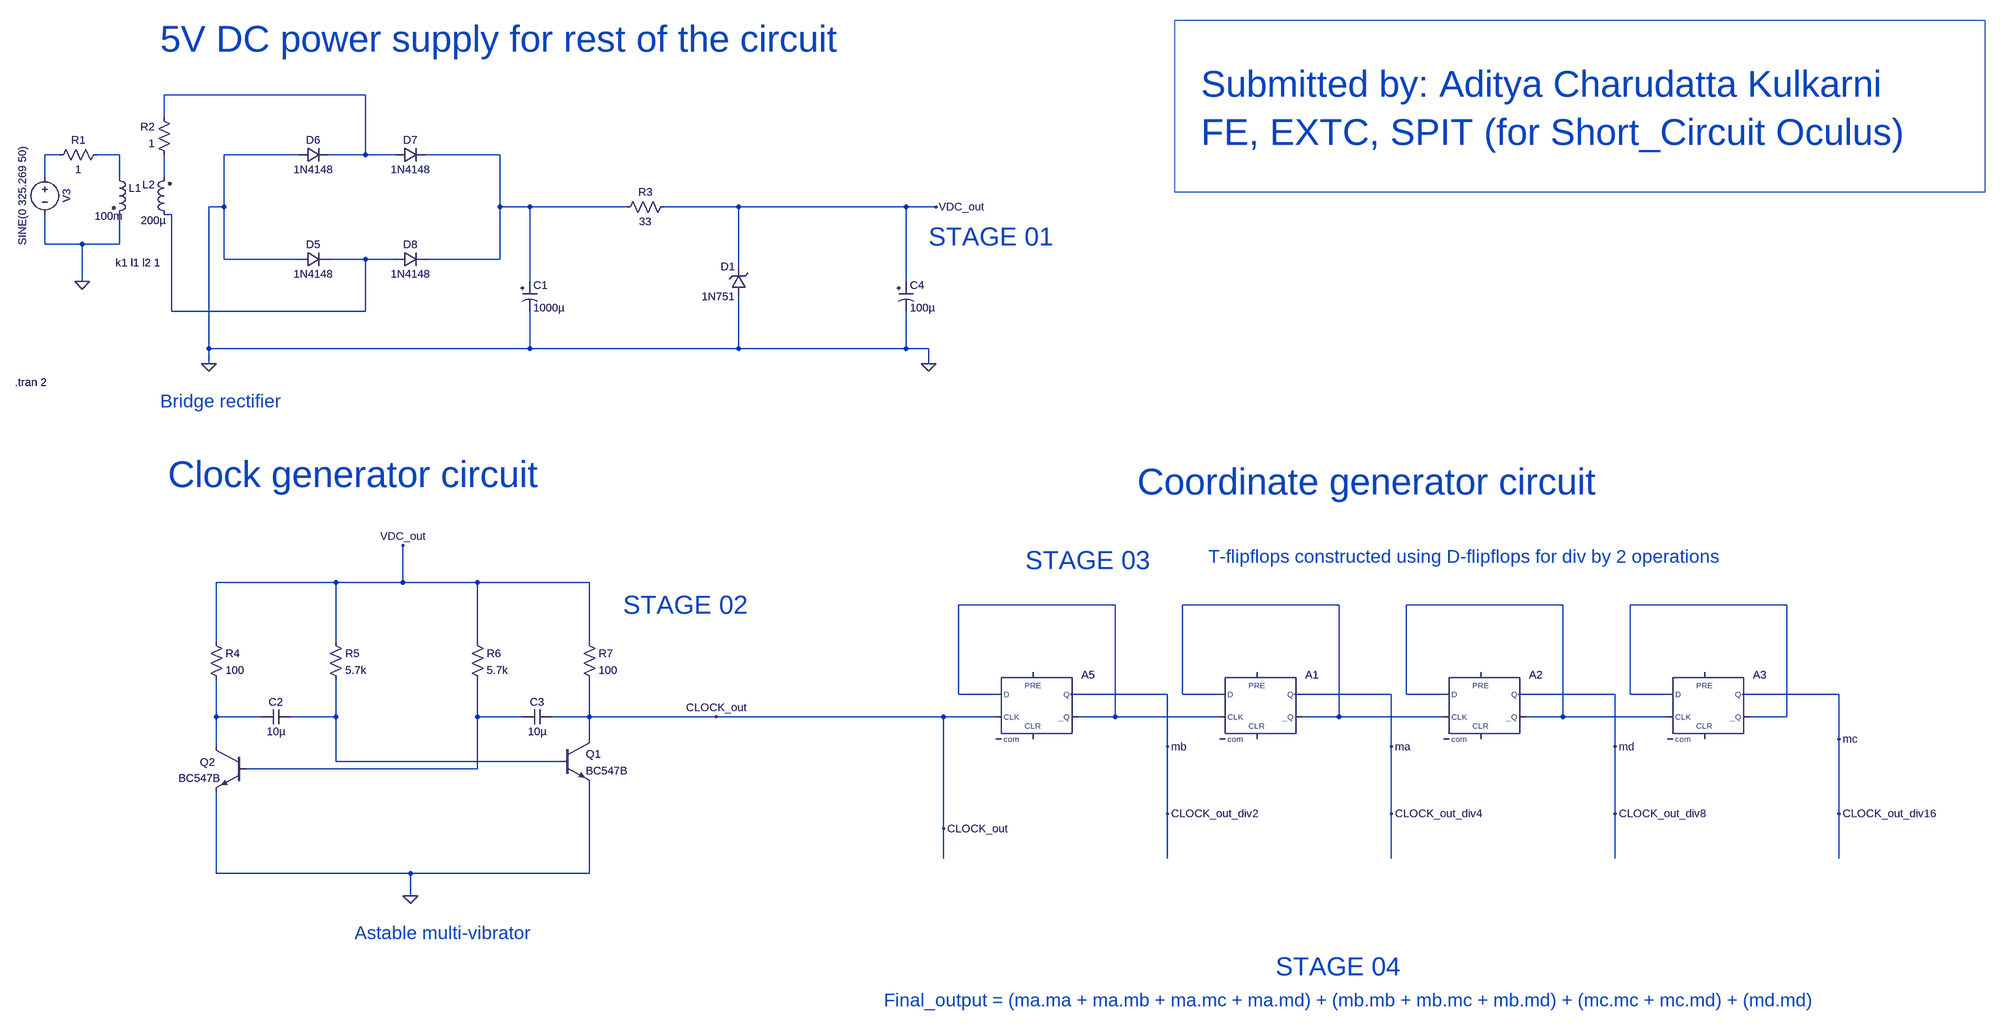
[diagram p0: schematic Oculuc_shortcircuit_powersupply.asc]
Oculuc_shortcircuit_powersupply.asc, the LTspice schematic file:
Version 4
SHEET 1 3616 2108
WIRE -512 80 -944 80
WIRE -944 128 -944 80
WIRE -1168 208 -1200 208
WIRE -1040 208 -1088 208
WIRE -656 208 -816 208
WIRE -512 208 -512 80
WIRE -512 208 -592 208
WIRE -448 208 -512 208
WIRE -224 208 -384 208
WIRE -1200 256 -1200 208
WIRE -1040 256 -1040 208
WIRE -944 256 -944 208
WIRE -816 320 -816 208
WIRE -816 320 -848 320
WIRE -224 320 -224 208
WIRE -160 320 -224 320
WIRE 48 320 -160 320
WIRE 288 320 128 320
WIRE 672 320 288 320
WIRE 736 320 672 320
WIRE -928 336 -944 336
WIRE -1200 400 -1200 336
WIRE -1120 400 -1200 400
WIRE -1040 400 -1040 336
WIRE -1040 400 -1120 400
WIRE -816 432 -816 320
WIRE -656 432 -816 432
WIRE -512 432 -592 432
WIRE -448 432 -512 432
WIRE -224 432 -224 320
WIRE -224 432 -384 432
WIRE 288 448 288 320
WIRE -1120 480 -1120 400
WIRE -160 480 -160 320
WIRE 672 480 672 320
WIRE -928 544 -928 336
WIRE -512 544 -512 432
WIRE -512 544 -928 544
WIRE -848 624 -848 320
WIRE -160 624 -160 544
WIRE -160 624 -848 624
WIRE 288 624 288 512
WIRE 288 624 -160 624
WIRE 672 624 672 544
WIRE 672 624 288 624
WIRE 720 624 672 624
WIRE -848 656 -848 624
WIRE 720 656 720 624
WIRE -576 1184 -832 1184
WIRE -432 1184 -432 1104
WIRE -432 1184 -576 1184
WIRE -272 1184 -432 1184
WIRE -32 1184 -272 1184
WIRE 1120 1232 784 1232
WIRE 1600 1232 1264 1232
WIRE 2080 1232 1744 1232
WIRE 2560 1232 2224 1232
WIRE -832 1312 -832 1184
WIRE -576 1312 -576 1184
WIRE -272 1312 -272 1184
WIRE -32 1312 -32 1184
WIRE 784 1424 784 1232
WIRE 864 1424 784 1424
WIRE 1232 1424 1024 1424
WIRE 1264 1424 1264 1232
WIRE 1344 1424 1264 1424
WIRE 1712 1424 1504 1424
WIRE 1744 1424 1744 1232
WIRE 1824 1424 1744 1424
WIRE 2192 1424 1984 1424
WIRE 2224 1424 2224 1232
WIRE 2304 1424 2224 1424
WIRE 2672 1424 2464 1424
WIRE -832 1472 -832 1392
WIRE -736 1472 -832 1472
WIRE -576 1472 -576 1392
WIRE -576 1472 -672 1472
WIRE -272 1472 -272 1392
WIRE -176 1472 -272 1472
WIRE -32 1472 -32 1392
WIRE -32 1472 -112 1472
WIRE 240 1472 -32 1472
WIRE 752 1472 240 1472
WIRE 864 1472 752 1472
WIRE 1120 1472 1120 1232
WIRE 1120 1472 1040 1472
WIRE 1344 1472 1120 1472
WIRE 1600 1472 1600 1232
WIRE 1600 1472 1520 1472
WIRE 1824 1472 1600 1472
WIRE 2080 1472 2080 1232
WIRE 2080 1472 2000 1472
WIRE 2304 1472 2080 1472
WIRE 2560 1472 2560 1232
WIRE 2560 1472 2480 1472
WIRE -32 1520 -32 1472
WIRE 2672 1520 2672 1424
WIRE -832 1536 -832 1472
WIRE 1232 1536 1232 1424
WIRE 1712 1536 1712 1424
WIRE 2192 1536 2192 1424
WIRE -576 1568 -576 1472
WIRE -96 1568 -576 1568
WIRE -272 1584 -272 1472
WIRE -272 1584 -768 1584
WIRE 1232 1680 1232 1536
WIRE 1712 1680 1712 1536
WIRE 2192 1680 2192 1536
WIRE 2672 1680 2672 1520
WIRE 752 1712 752 1472
WIRE 752 1776 752 1712
WIRE 1232 1776 1232 1680
WIRE 1712 1776 1712 1680
WIRE 2192 1776 2192 1680
WIRE 2672 1776 2672 1680
WIRE -832 1808 -832 1632
WIRE -416 1808 -832 1808
WIRE -32 1808 -32 1616
WIRE -32 1808 -416 1808
WIRE -416 1856 -416 1808
FLAG -848 656 0
FLAG -1120 480 0
FLAG 736 320 VDC_out
FLAG 720 656 0
FLAG -416 1856 0
FLAG -432 1104 VDC_out
FLAG 240 1472 CLOCK_out
FLAG 1712 1680 CLOCK_out_div4
FLAG 2192 1680 CLOCK_out_div8
FLAG 2672 1680 CLOCK_out_div16
FLAG 1232 1680 CLOCK_out_div2
FLAG 752 1712 CLOCK_out
FLAG 1712 1536 ma
FLAG 1232 1536 mb
FLAG 2192 1536 md
FLAG 2672 1520 mc
SYMBOL voltage -1200 240 R0
WINDOW 0 32 56 VTop 2
WINDOW 3 -32 56 VBottom 2
WINDOW 123 0 0 Left 0
WINDOW 39 0 0 Left 0
SYMATTR InstName V3
SYMATTR Value SINE(0 325.269 50)
SYMBOL diode -656 448 R270
WINDOW 0 32 32 VTop 2
WINDOW 3 0 32 VBottom 2
SYMATTR InstName D5
SYMATTR Value 1N4148
SYMBOL diode -656 224 R270
WINDOW 0 32 32 VTop 2
WINDOW 3 0 32 VBottom 2
SYMATTR InstName D6
SYMATTR Value 1N4148
SYMBOL diode -448 224 R270
WINDOW 0 32 32 VTop 2
WINDOW 3 0 32 VBottom 2
SYMATTR InstName D7
SYMATTR Value 1N4148
SYMBOL diode -448 448 R270
WINDOW 0 32 32 VTop 2
WINDOW 3 0 32 VBottom 2
SYMATTR InstName D8
SYMATTR Value 1N4148
SYMBOL polcap -176 480 R0
WINDOW 3 24 56 Left 2
SYMATTR Value 1000µ
SYMATTR InstName C1
SYMATTR Description Capacitor
SYMATTR Type cap
SYMATTR SpiceLine V=2 Irms=3 Rser=0.006 Lser=0
SYMBOL ind2 -1056 240 R0
WINDOW 3 -37 100 Left 2
SYMATTR Value 100m
SYMATTR InstName L1
SYMATTR Type ind
SYMBOL ind2 -928 352 R180
WINDOW 0 36 80 Left 2
WINDOW 3 12 3 Left 2
SYMATTR InstName L2
SYMATTR Value 200µ
SYMATTR Type ind
SYMBOL res -1072 192 R90
WINDOW 0 0 56 VBottom 2
WINDOW 3 32 56 VTop 2
SYMATTR InstName R1
SYMATTR Value 1
SYMBOL res -928 224 R180
WINDOW 0 36 76 Left 2
WINDOW 3 36 40 Left 2
SYMATTR InstName R2
SYMATTR Value 1
SYMBOL zener 304 512 R180
WINDOW 0 24 64 Left 2
WINDOW 3 24 0 Left 2
SYMATTR InstName D1
SYMATTR Value 1N751
SYMBOL res 144 304 R90
WINDOW 0 0 56 VBottom 2
WINDOW 3 32 56 VTop 2
SYMATTR InstName R3
SYMATTR Value 33
SYMBOL res -848 1296 R0
SYMATTR InstName R4
SYMATTR Value 100
SYMBOL res -592 1296 R0
SYMATTR InstName R5
SYMATTR Value 5.7k
SYMBOL res -288 1296 R0
SYMATTR InstName R6
SYMATTR Value 5.7k
SYMBOL res -48 1296 R0
SYMATTR InstName R7
SYMATTR Value 100
SYMBOL npn -96 1520 R0
SYMATTR InstName Q1
SYMATTR Value BC547B
SYMBOL npn -768 1536 M0
WINDOW 0 67 34 Left 2
SYMATTR InstName Q2
SYMATTR Value BC547B
SYMBOL cap -672 1456 R90
WINDOW 0 0 32 VBottom 2
WINDOW 3 32 32 VTop 2
SYMATTR InstName C2
SYMATTR Value 10µ
SYMBOL cap -112 1456 R90
WINDOW 0 0 32 VBottom 2
WINDOW 3 32 32 VTop 2
SYMATTR InstName C3
SYMATTR Value 10µ
SYMBOL Digital\\dflop 944 1376 R0
SYMATTR InstName A5
SYMBOL Digital\\dflop 1424 1376 R0
SYMATTR InstName A1
SYMBOL Digital\\dflop 1904 1376 R0
SYMATTR InstName A2
SYMBOL Digital\\dflop 2384 1376 R0
SYMATTR InstName A3
SYMBOL polcap 656 480 R0
WINDOW 3 24 56 Left 2
SYMATTR Value 100µ
SYMATTR InstName C4
SYMATTR Description Capacitor
SYMATTR Type cap
SYMATTR SpiceLine V=2 Irms=3 Rser=0.006 Lser=0
TEXT -1264 696 Left 2 !.tran 2
TEXT -1048 440 Left 2 !k1 l1 l2 1
TEXT -952 -40 Left 6 ;5V DC power supply for rest of the circuit
TEXT 624 2080 Left 4 ;Final_output = (ma.ma + ma.mb + ma.mc + ma.md) + (mb.mb + mb.mc + mb.md) + (mc.mc + mc.md) + (md.md)
TEXT 720 384 Left 5 ;STAGE 01
TEXT 40 1232 Left 5 ;STAGE 02
TEXT 928 1136 Left 5 ;STAGE 03
TEXT 1464 2008 Left 5 ;STAGE 04
TEXT -952 736 Left 4 ;Bridge rectifier
TEXT -536 1936 Left 4 ;Astable multi-vibrator
TEXT 1320 1128 Left 4 ;T-flipflops constructed using D-flipflops for div by 2 operations
TEXT -936 952 Left 6 ;Clock generator circuit
TEXT 1168 968 Left 6 ;Coordinate generator circuit
TEXT 1304 56 Left 6 ;Submitted by: Aditya Charudatta Kulkarni\nFE, EXTC, SPIT (for Short_Circuit Oculus)
RECTANGLE Normal 2992 288 1248 -80

The netlist it stands for:
* Oculuc_shortcircuit_powersupply.asc
V3 N002 0 SINE(0 325.269 50)
D5 0 N006 1N4148
D6 0 N001 1N4148
D7 N001 N004 1N4148
D8 N006 N004 1N4148
C1 N004 0 1000µ V=2 Irms=3 Rser=0.006 Lser=0
L1 N003 0 100m
L2 N006 N005 200µ
R1 N003 N002 1
R2 N005 N001 1
D1 0 VDC_out 1N751
R3 VDC_out N004 33
R4 VDC_out N011 100
R5 VDC_out N012 5.7k
R6 VDC_out N013 5.7k
R7 VDC_out CLOCK_out 100
Q1 CLOCK_out N012 0 0 BC547B
Q2 N011 N013 0 0 BC547B
C2 N012 N011 10µ
C3 CLOCK_out N013 10µ
A5 N007 0 CLOCK_out 0 0 N007 mb 0 DFLOP
A1 N008 0 N007 0 0 N008 ma 0 DFLOP
A2 N009 0 N008 0 0 N009 md 0 DFLOP
A3 N010 0 N009 0 0 N010 mc 0 DFLOP
C4 VDC_out 0 100µ V=2 Irms=3 Rser=0.006 Lser=0
.model D D
.lib standard.dio
.model NPN NPN
.model PNP PNP
.lib standard.bjt
.tran 2
k1 l1 l2 1
* 5V DC power supply for rest of the circuit
* Final_output = (ma.ma + ma.mb + ma.mc + ma.md) + (mb.mb + mb.mc + mb.md) + (mc.mc + mc.md) + (md.md)
* STAGE 01
* STAGE 02
* STAGE 03
* STAGE 04
* Bridge rectifier
* Astable multi-vibrator
* T-flipflops constructed using D-flipflops for div by 2 operations
* Clock generator circuit
* Coordinate generator circuit
* Submitted by: Aditya Charudatta Kulkarni
* FE, EXTC, SPIT (for Short_Circuit Oculus)
.backanno
.end